# EAGLE design quadrotor (EAGLE 5.00)
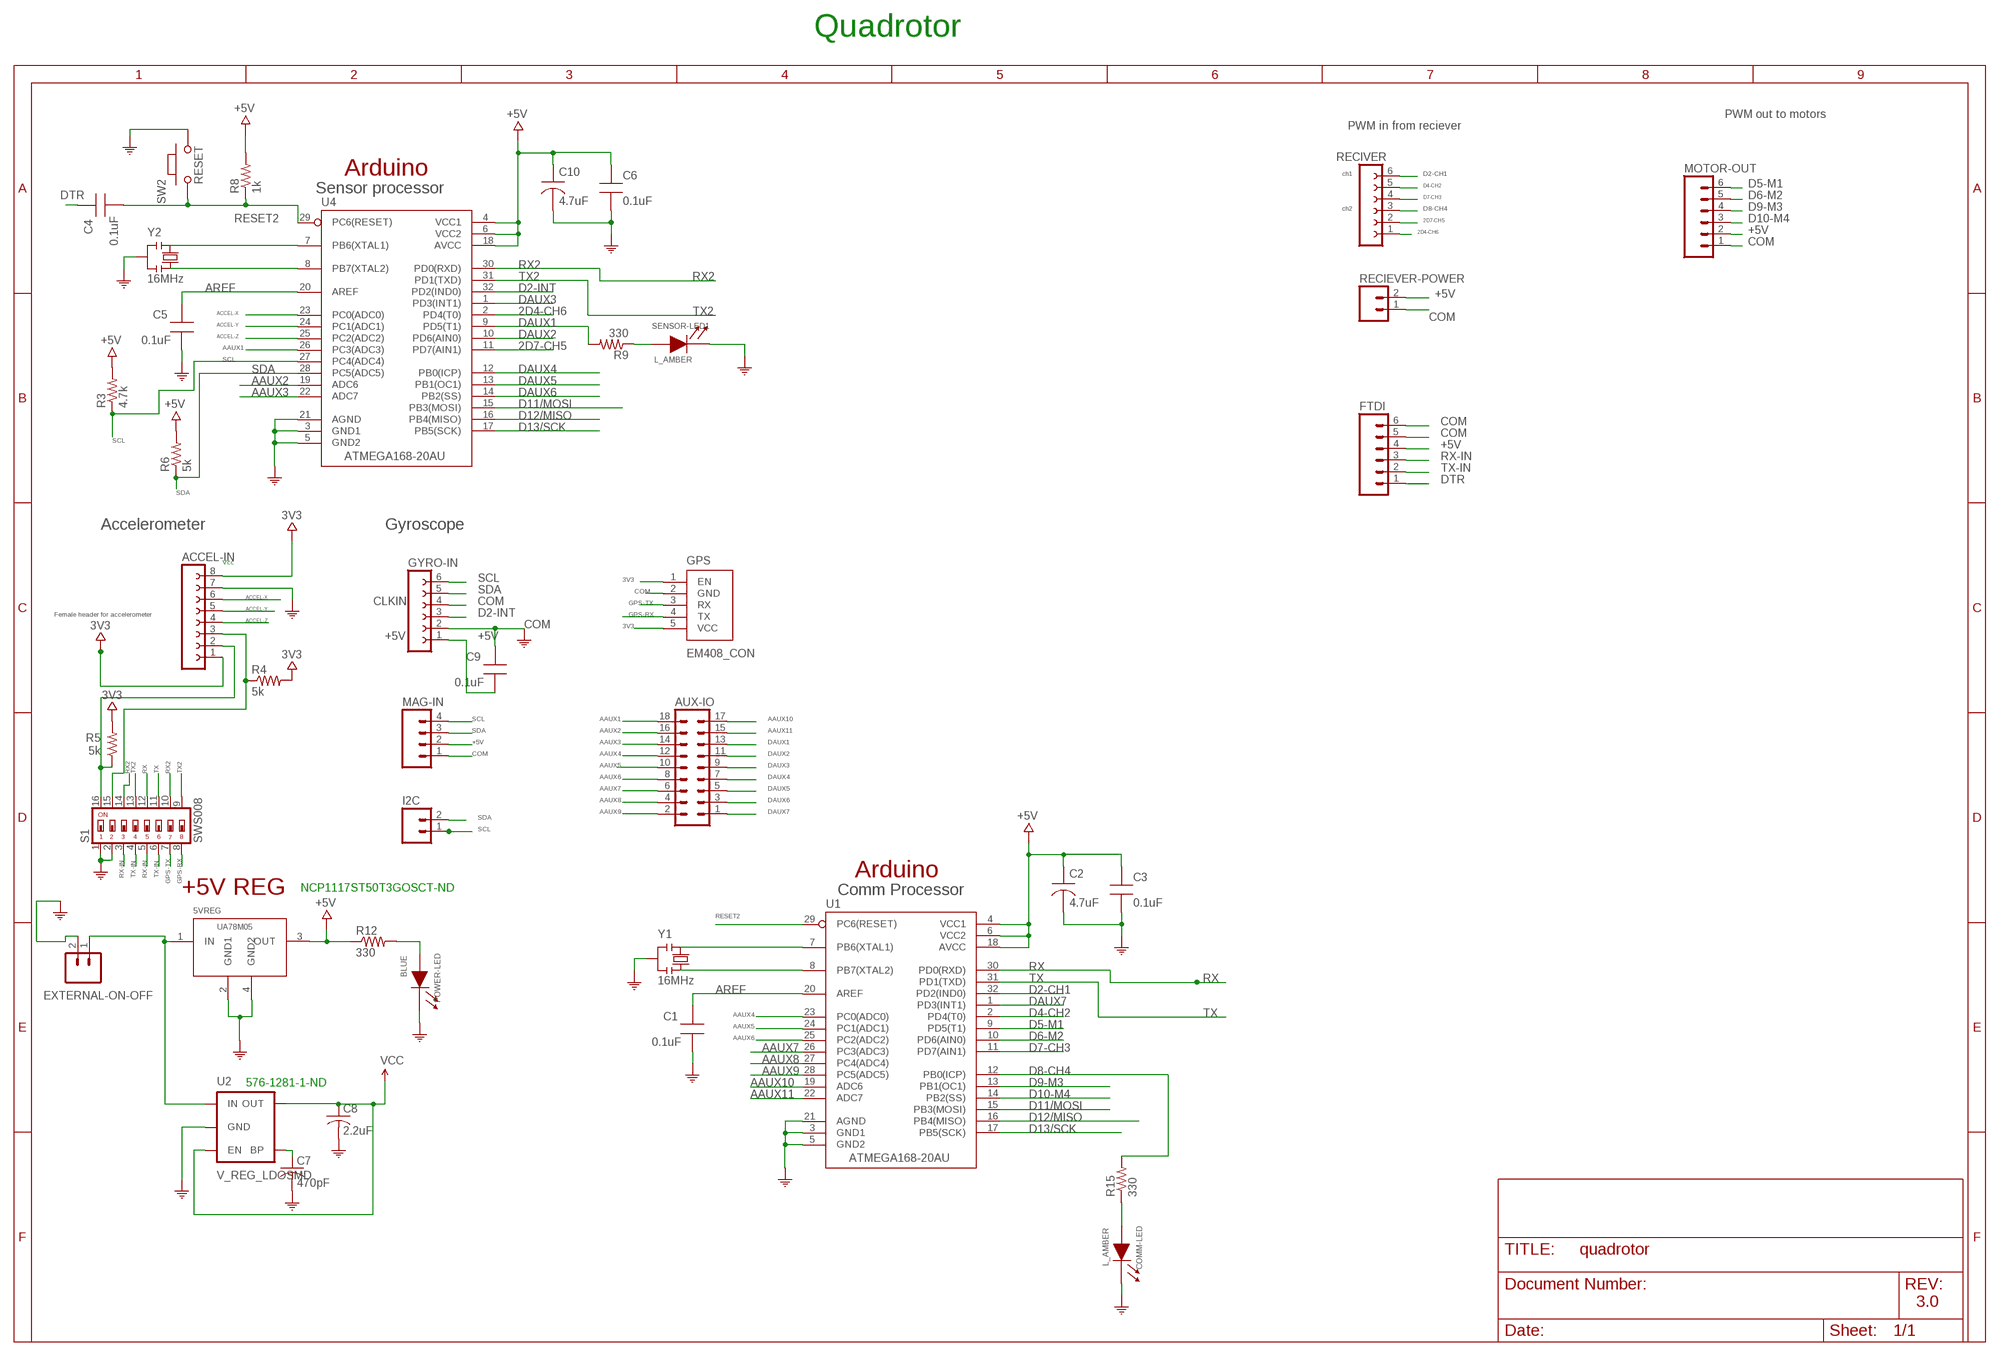
[diagram p0: schematic, sheet 1]

## Parts
5VREG  UA78M05  [SOT223]
ACCEL-IN  FE08-1  [FE08]
AUX-IO  MA09-2  [MA09-2]
C1  0.1uF  CAP0805-NP  [CAP0805-NP]
C2  4.7uF  CAP-TANA-P  [TAN-A]
C3  0.1uF  CAP0805-NP  [CAP0805-NP]
C4  0.1uF  CAP0805-NP  [CAP0805-NP]
C5  0.1uF  CAP0805-NP  [CAP0805-NP]
C6  0.1uF  CAP0805-NP  [CAP0805-NP]
C7  470pF  C-USC0805  [C0805]
C8  2.2uF  C-USC0805  [C0805]
C9  0.1uF  CAP0805-NP  [CAP0805-NP]
C10  4.7uF  CAP-TANA-P  [TAN-A]
COMM-LED  L_AMBER  LED0805  [LED0805]
EXTERNAL-ON-OFF  M02PTH3  [1X02_LONGPADS]
FTDI  M06SIP  [1X06]
GPS  EM408_CON  [EM408_CON]
GYRO-IN  FE06-1  [FE06]
I2C  M02PTH  [1X02]
MAG-IN  M04PTH  [1X04]
MOTOR-OUT  M06SIP  [1X06]
POWER-LED  BLUE  LED0805  [LED0805]
R3  4.7k  R-US_M0805  [M0805]
R4  5k  R-US_M0805  [M0805]
R5  5k  R-US_M0805  [M0805]
R6  5k  R-US_M0805  [M0805]
R8  1k  RESISTOR0603-RES  [0603-RES]
R9  330  RESISTOR0603-RES  [0603-RES]
R12  330  RESISTOR0603-RES  [0603-RES]
R15  330  RESISTOR0603-RES  [0603-RES]
RECIEVER-POWER  M02PTH  [1X02]
RECIVER  FE06-1  [FE06]
S1  SWS008  [SMS-008]
SENSOR-LED1  L_AMBER  LED0805  [LED0805]
SW2  RESET  PB157  [157SW]
U1  ATMEGA168-20AU  [QFP032]
U2  V_REG_LDOSMD  [SOT23-5]
U4  ATMEGA168-20AU  [QFP032]
Y1  16MHz  RESONATORMU  [RESONATOR]
Y2  16MHz  RESONATORMU  [RESONATOR]

## Nets
2D4-CH6: RECIVER.1 U4.2(PD4(T0))
2D7-CH5: RECIVER.2 U4.11(PD7(AIN1))
3V3: ACCEL-IN.1 ACCEL-IN.8 C8.1 GPS.1(EN) GPS.5(VCC) R4.2 R5.2 U2.3(EN) U2.5(OUT) ; supply symbol labelled VCC
+5V: 5VREG.3(OUT) C2.1 C3.1 C6.1 C9.2 C10.1 FTDI.4 GYRO-IN.1 MAG-IN.2 MOTOR-OUT.2 R3.2 R6.2 R8.2 R12.1 RECIEVER-POWER.2 U1.4(VCC1) U1.6(VCC2) U1.18(AVCC) U4.4(VCC1) U4.6(VCC2) U4.18(AVCC)
AAUX1: AUX-IO.18 U4.26(PC3(ADC3))
AAUX2: AUX-IO.16 U4.19(ADC6)
AAUX3: AUX-IO.14 U4.22(ADC7)
AAUX4: AUX-IO.12 U1.23(PC0(ADC0))
AAUX5: AUX-IO.10 U1.24(PC1(ADC1))
AAUX6: AUX-IO.8 U1.25(PC2(ADC2))
AAUX7: AUX-IO.6 U1.26(PC3(ADC3))
AAUX8: AUX-IO.4 U1.27(PC4(ADC4))
AAUX9: AUX-IO.2 U1.28(PC5(ADC5))
AAUX10: AUX-IO.17 U1.19(ADC6)
AAUX11: AUX-IO.15 U1.22(ADC7)
ACCEL-X: ACCEL-IN.6 U4.23(PC0(ADC0))
ACCEL-Y: ACCEL-IN.5 U4.24(PC1(ADC1))
ACCEL-Z: ACCEL-IN.4 U4.25(PC2(ADC2))
AREF: C1.1 C5.1 U1.20(AREF) U4.20(AREF)
COM: 5VREG.2(GND1) 5VREG.4(GND2) ACCEL-IN.7 C1.2 C2.2 C3.2 C5.2 C6.2 C7.2 C8.2 C9.1 C10.2 COMM-LED.1(CA) EXTERNAL-ON-OFF.2 FTDI.5 FTDI.6 GPS.2(GND) GYRO-IN.2 GYRO-IN.4 MAG-IN.1 MOTOR-OUT.1 POWER-LED.1(CA) RECIEVER-POWER.1 S1.1 S1.2 SENSOR-LED1.1(CA) SW2.2 U1.3(GND1) U1.5(GND2) U1.21(AGND) U2.2(GND) U4.3(GND1) U4.5(GND2) U4.21(AGND) Y1.2 Y2.2
D2-CH1: RECIVER.6 U1.32(PD2(IND0))
D2-INT: GYRO-IN.3 U4.32(PD2(IND0))
D4-CH2: RECIVER.5 U1.2(PD4(T0))
D5-M1: MOTOR-OUT.6 U1.9(PD5(T1))
D6-M2: MOTOR-OUT.5 U1.10(PD6(AIN0))
D7-CH3: RECIVER.4 U1.11(PD7(AIN1))
D8-CH4: R15.2 RECIVER.3 U1.12(PB0(ICP))
D9-M3: MOTOR-OUT.4 U1.13(PB1(OC1))
D10-M4: MOTOR-OUT.3 U1.14(PB2(SS))
D11/MOSI: U1.15(PB3(MOSI)) U4.15(PB3(MOSI))
D12/MISO: U1.16(PB4(MISO)) U4.16(PB4(MISO))
D13/SCK: U1.17(PB5(SCK)) U4.17(PB5(SCK))
DAUX1: AUX-IO.13 R9.2 U4.9(PD5(T1))
DAUX2: AUX-IO.11 U4.10(PD6(AIN0))
DAUX3: AUX-IO.9 U4.1(PD3(INT1))
DAUX4: AUX-IO.7 U4.12(PB0(ICP))
DAUX5: AUX-IO.5 U4.13(PB1(OC1))
DAUX6: AUX-IO.3 U4.14(PB2(SS))
DAUX7: AUX-IO.1 U1.1(PD3(INT1))
DTR: C4.1 FTDI.1
GPS-RX: GPS.4(TX) S1.8
GPS-TX: GPS.3(RX) S1.7
N$1: U1.8(PB7(XTAL2)) Y1.3
N$2: U1.7(PB6(XTAL1)) Y1.1
N$4: R9.1 SENSOR-LED1.2(AN)
N$5: 5VREG.1(IN) EXTERNAL-ON-OFF.1 U2.1(IN)
N$7: COMM-LED.2(AN) R15.1
N$28: POWER-LED.2(AN) R12.2
N$30: U4.7(PB6(XTAL1)) Y2.1
N$32: U4.8(PB7(XTAL2)) Y2.3
N$34: ACCEL-IN.3 R4.1 S1.15
N$36: ACCEL-IN.2 R5.1 S1.16
N$41: C7.1 U2.4(BP)
RESET2: C4.2 R8.1 SW2.1 U1.29(PC6(RESET)) U4.29(PC6(RESET))
RX: S1.12 U1.30(PD0(RXD))
RX2: S1.10 S1.14 U4.30(PD0(RXD))
RX-IN: FTDI.3 S1.3 S1.5
SCL: GYRO-IN.6 I2C.1 MAG-IN.4 R3.1 U4.27(PC4(ADC4))
SDA: GYRO-IN.5 I2C.2 MAG-IN.3 R6.1 U4.28(PC5(ADC5))
TX: S1.11 U1.31(PD1(TXD))
TX2: S1.9 S1.13 U4.31(PD1(TXD))
TX-IN: FTDI.2 S1.4 S1.6

## Notes on the sheet
- Quadrotor
- PWM out to motors
- PWM in from reciever
- Arduino | ch1
- Sensor processor
- ch2
- Accelerometer | Gyroscope
- Vcc
- CLKIN
- Female header for accelerometer
- Arduino
- NCP1117ST50T3GOSCT-ND
- +5V REG | Comm Processor
- 576-1281-1-ND
- 3.0

## Library data of the parts
5VREG = MySMD:UA78M05
ACCEL-IN = con-lsta:FE08-1: FEMALE HEADER; OC_FARNELL: unknown; OC_NEWARK: unknown
AUX-IO = con-lstb:MA09-2: PIN HEADER; OC_FARNELL: unknown; OC_NEWARK: unknown
C1 C3-C6 C9 = MySMD:CAP0805-NP
C2 C10 = MySMD:CAP-TANA-P
C7 C8 = rcl:C-US: CAPACITOR, American symbol
COMM-LED POWER-LED SENSOR-LED1 = MySMD:LED0805
EXTERNAL-ON-OFF I2C RECIEVER-POWER = SparkFun:M02: Header 2 Standard 2-pin 0.1" header. Use with straight break away headers (SKU : PRT-00116), right angle break away headers (PRT-00553), swiss pins (PRT-00743), machine pins (PRT-00117), and female headers (PRT-00115). Molex polarized connector foot print use with SKU : PRT-08233 with associated crimp pins and housings.
FTDI MOTOR-OUT = SparkFun:M06: Header 6 Standard 6-pin 0.1" header. Use with straight break away headers (SKU : PRT-00116), right angle break away headers (PRT-00553), swiss pins (PRT-00743), machine pins (PRT-00117), and female headers (PRT-00115). Molex polarized connector foot print use with SKU : PRT-08094 with associated crimp pins and housings. NOTES ON THE VARIANTS LOCK and LOCK_LONGPADS... This footprint was designed to help hold the alignment of a through-hole component (i.e. 6-pin header) while soldering it into place. You may notice that each hole has been shifted either up or down by 0.005 of an inch from it's more standard position (which is a perfectly straight line). This slight alteration caused the pins (the squares in the middle) to touch the edges of the holes. Because they are alternating, it causes a "brace" to hold the component in place. 0.005 has proven to be the perfect amount of "off-center" position when using our standard breakaway headers. Although looks a little odd when you look at the bare footprint, once you have a header in there, the alteration is very hard to notice. Also, if you push a header all the way into place, it is covered up entirely on the bottom side. This idea of altering the position of holes to aid alignment will be further integrated into the Sparkfun Library for other footprints. It can help hold any component with 3 or more connection pins.
GPS = SparkFun:EM408_CON: This is the mating connector for the EM408 GPS receiver. The EM408 connects to the board via a cable, this connector footprint does not include the outline of the receiver. You should include the "EM408_Outline" device in your schematic if you are to use the EM408 in your design.
GYRO-IN RECIVER = con-lsta:FE06-1: FEMALE HEADER; OC_FARNELL: unknown; OC_NEWARK: unknown
MAG-IN = SparkFun:M04: Header 4 Standard 4-pin 0.1" header. Use with straight break away headers (SKU : PRT-00116), right angle break away headers (PRT-00553), swiss pins (PRT-00743), machine pins (PRT-00117), and female headers (PRT-00115). Molex polarized connector foot print use with SKU : PRT-08231 with associated crimp pins and housings. 1MM SMD Version SKU: PRT-10208
R3-R6 = resistor:R-US_: RESISTOR, American symbol
R8 R9 R12 R15 = SparkFun:RESISTOR: Resistor Basic schematic elements and footprints for 0603, 1206, and PTH resistors.
S1 = smd-special:SWS008: SMD Dip Switch 8 pol.
SW2 = MySMD:PB157
U1 U4 = MySMD:ATMEGA168-20AU
U2 = SparkFun:V_REG_LDO: Voltage Regulator LDO Standard 150mA LDO voltage regulator in SOT-23 layout. Micrel part MIC5205. BP (by-pass) pin is used to lower output noise with 470pF cap.
Y1 Y2 = MySMD2:RESONATOR

## Board
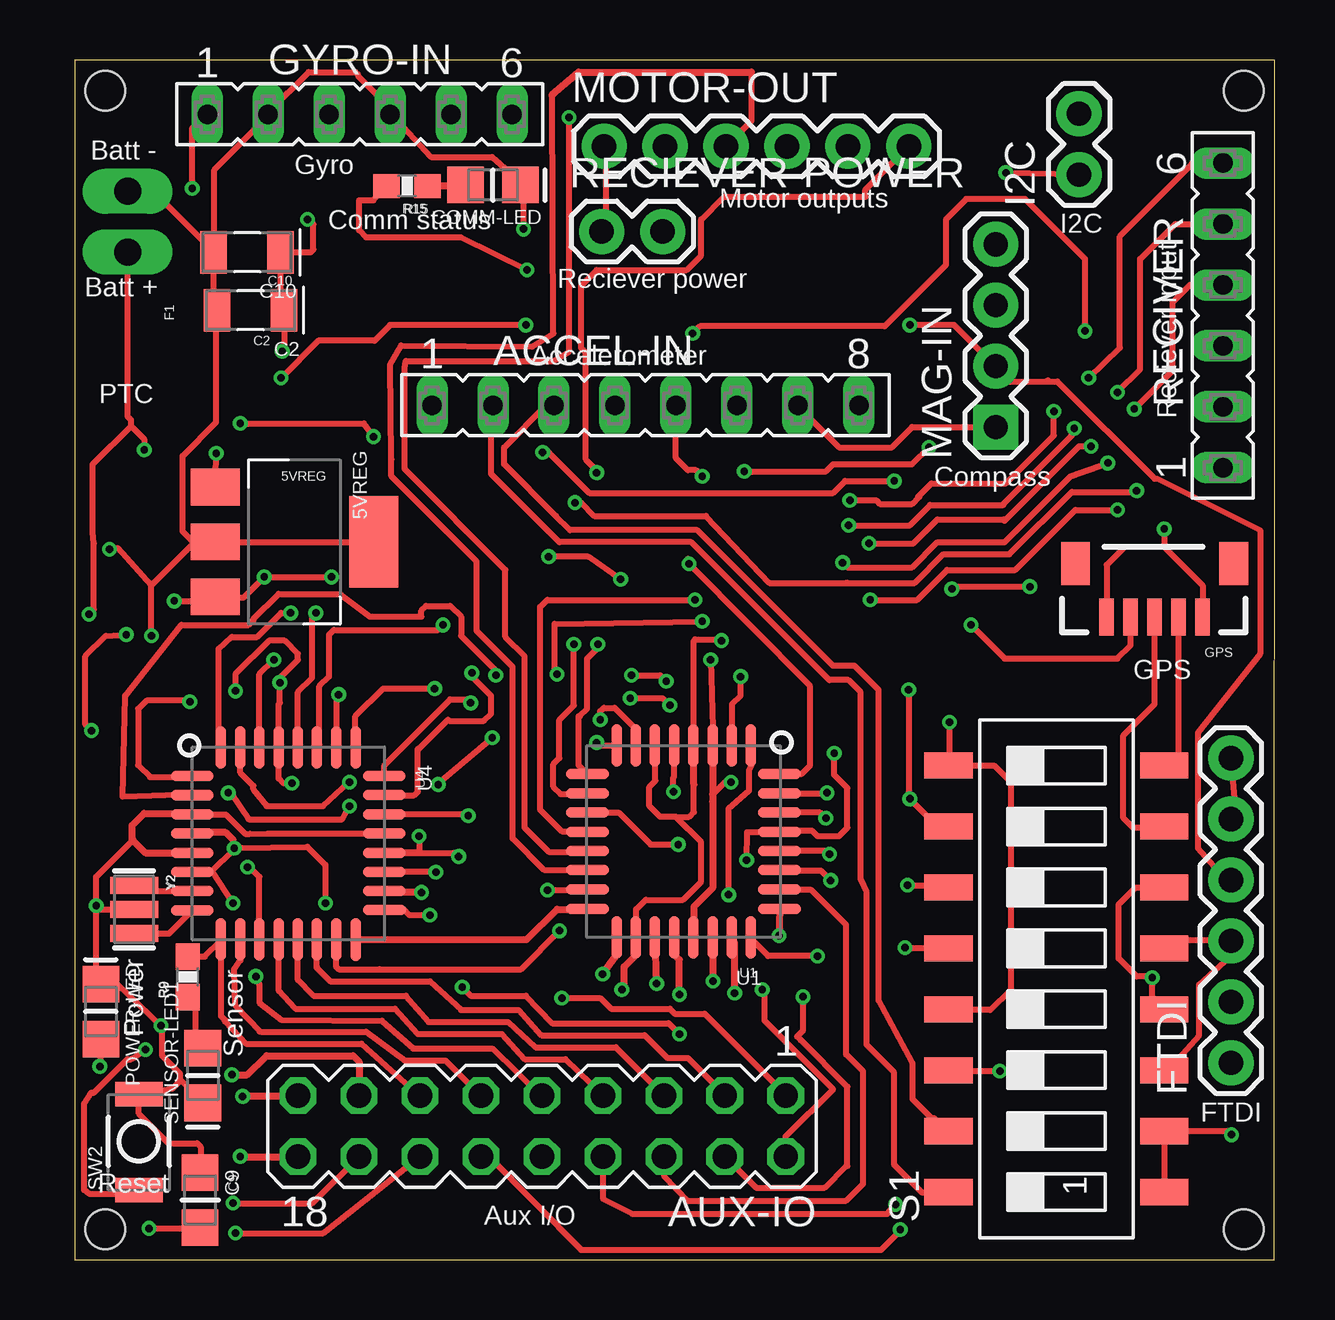
[diagram p1: board, top side]
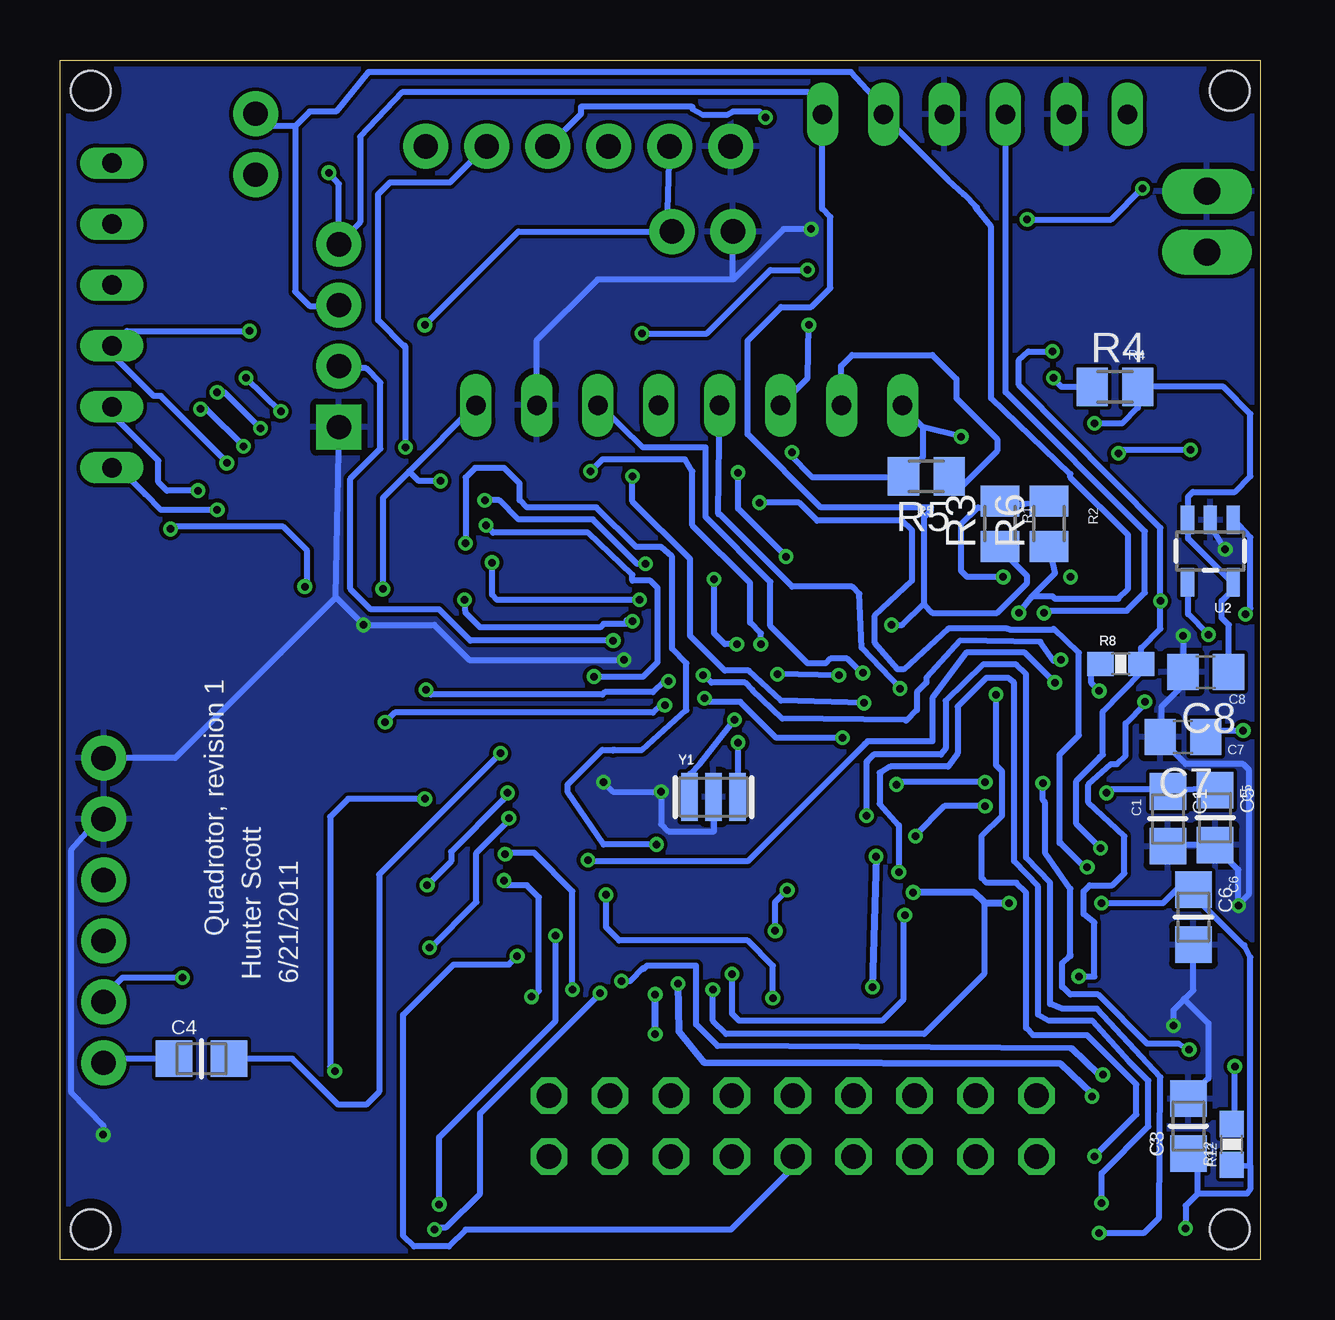
[diagram p2: board, bottom side, seen from below]

Size 50 x 50 mm. Coordinates in mm from the lower left corner, seen from the top.
Outline: 0,0 49.98,0 50,50 0,50 0,0
Copper layers (1*16): Top 0.035mm / dielectric 1.5mm / Bottom 0.035mm
Design rules "ITead_rule": minimum track width 6mil, minimum drill 12mil, track to track 6mil, track to pad 6mil, pad to pad 6mil, via to via 6mil, smd to smd 0mil, copper to edge 10mil, drill to drill 10mil, minimum pad ring 10mil, minimum via ring 6mil, stop-mask expansion 2mil, vias tented up to drill 100mil, thermal gap 10mil
Holes 1.65 mm at 1.27,1.27 48.71,1.27 48.71,48.71 1.27,48.71
tRestrict: area 0.1,0.1 to 2.4,2.4; area 47.6,47.6 to 49.9,49.9; area 47.6,0.1 to 49.9,2.4; area 0.1,47.6 to 2.4,49.9
bRestrict: area 47.6,0.1 to 49.9,2.4; area 0.1,47.6 to 2.4,49.9; area 47.6,47.6 to 49.9,49.9; area 0.1,0.1 to 2.4,2.4

### Footprints (pad centres in the part's own frame; a part is rotated, then mirrored left to right if it is on the bottom)
SOT223 = smd 1.524 x 2.032: 1 0,0; 2 2.286,0; 3 4.572,0 | smd 3.81 x 2.032: 4 2.286,6.604
FE08 = drill 0.813 long: 1 -8.89,0; 2 -6.35,0; 3 -3.81,0; 4 -1.27,0; 5 1.27,0; 6 3.81,0; 7 6.35,0; 8 8.89,0
MA09-2 = drill 1.016 octagon: 1 -10.16,-1.27; 2 -10.16,1.27; 3 -7.62,-1.27; 4 -7.62,1.27; 5 -5.08,-1.27; 6 -5.08,1.27; 7 -2.54,-1.27; 8 -2.54,1.27; 9 0,-1.27; 10 0,1.27; 11 2.54,-1.27; 12 2.54,1.27; 13 5.08,-1.27; 14 5.08,1.27; 15 7.62,-1.27; 16 7.62,1.27; 17 10.16,-1.27; 18 10.16,1.27
CAP0805-NP = smd 1.524 x 1.524: 1 0,0; 2 2.286,0
TAN-A = smd 1.118 x 1.778: 1 0,0; 2 2.794,0
C0805 = smd 1.3 x 1.5: 1 -0.95,0; 2 0.95,0
LED0805 = smd 1.524 x 1.524: 1 0,0; 2 2.286,0
1X02_LONGPADS = drill 1.118 pad 1.88 long: 1 0,0; 2 2.54,0
1X06 = drill 1.016 pad 1.88 round: 1 0,0; 2 2.54,0; 3 5.08,0; 4 7.62,0; 5 10.16,0; 6 12.7,0
EM408_CON = smd 0.6 x 1.55: 1 4,0; 2 3,0; 3 2,0; 4 1,0; 5 0,0 | smd 1.2 x 1.8: P$1 -1.3,-2.225; P$2 5.3,-2.225
FE06 = drill 0.813 long: 1 -6.35,0; 2 -3.81,0; 3 -1.27,0; 4 1.27,0; 5 3.81,0; 6 6.35,0
1X02 = drill 1.016 pad 1.88 round: 1 0,0; 2 2.54,0
1X04 = drill 1.016 pad 1.88 square: 1 0,0 | drill 1.016 pad 1.88 round: 2 2.54,0; 3 5.08,0; 4 7.62,0
M0805 = smd 1.3 x 1.6: 1 -0.95,0; 2 0.95,0
0603-RES = smd 1.1 x 1: 1 -0.85,0; 2 0.85,0
SMS-008 = smd 1.092 x 2.007: 1 -8.89,-4.496; 2 -6.35,-4.496; 3 -3.81,-4.496; 4 -1.27,-4.496; 5 1.27,-4.496; 6 3.81,-4.496; 7 6.35,-4.496; 8 8.89,-4.496; 9 8.89,4.496; 10 6.35,4.496; 11 3.81,4.496; 12 1.27,4.496; 13 -1.27,4.496; 14 -3.81,4.496; 15 -6.35,4.496; 16 -8.89,4.496
157SW = smd 1.016 x 1.981: 1 0,0; 2 4,0
QFP032 = smd 0.432 x 1.778: 1 0,0; 2 0.8,0; 3 1.599,0; 4 2.399,0; 5 3.199,0; 6 3.998,0; 7 4.798,0; 8 5.598,0; 17 5.588,8.001; 18 4.798,7.997; 19 3.998,7.997; 20 3.199,7.997; 21 2.399,7.997; 22 1.599,7.997; 23 0.799,7.997; 24 0,7.997 | smd 1.778 x 0.432: 9 6.807,1.194; 10 6.807,2.007; 11 6.807,2.794; 12 6.807,3.607; 13 6.807,4.394; 14 6.807,5.182; 15 6.807,5.994; 16 6.816,6.803; 25 -1.194,6.807; 26 -1.194,5.994; 27 -1.194,5.182; 28 -1.194,4.394; 29 -1.194,3.607; 30 -1.194,2.794; 31 -1.194,2.007; 32 -1.194,1.194
SOT23-5 = smd 0.55 x 1.2: 1 -0.95,-1.3; 2 0,-1.3; 3 0.95,-1.3; 4 0.95,1.3; 5 -0.95,1.3
RESONATOR = smd 0.7 x 2: 1 -1,0; 2 0,0; 3 1,0

### Placement (x,y rotation side)
5VREG  5.86,32.2 270 top
ACCEL-IN  23.78,35.61 0 top
AUX-IO  19.47,5.56 180 top
C1  3.84,19.51 270 bottom
C2  8.72,39.57 180 top
C3  2.99,4.42 90 bottom
C4  45.25,8.37 0 bottom
C5  1.87,19.56 270 bottom
C6  2.77,15.41 270 bottom
C7  3.21,21.78 180 bottom
C8  2.26,24.48 180 bottom
C9  5.23,3.62 270 top
C10  8.58,41.98 180 top
COMM-LED  18.57,44.78 180 top
EXTERNAL-ON-OFF  2.21,41.99 90 top
FTDI  48.18,8.2 90 top
GPS  47,26.78 180 top
GYRO-IN  11.88,47.74 0 top
I2C  41.85,45.22 90 top
MAG-IN  38.38,34.7 90 top
MOTOR-OUT  22.06,46.4 0 top
POWER-LED  1.09,11.48 270 top
R3  10.84,30.67 90 bottom
R4  6.04,36.38 0 bottom
R5  13.9,32.64 180 bottom
R6  8.79,30.67 90 bottom
R8  5.8,24.82 0 bottom
R9  4.71,11.78 90 top
R12  1.18,4.8 90 bottom
R15  13.85,44.75 180 top
RECIEVER-POWER  21.96,42.85 0 top
RECIVER  47.84,39.35 90 top
S1  40.91,11.7 90 top
SENSOR-LED1  5.34,6.53 90 top
SW2  2.68,2.89 90 top
U1  28.18,21.43 180 top
U2  2.07,29.53 180 bottom
U4  4.9,20.15 270 top
Y1  22.77,19.27 0 bottom
Y2  2.48,14.59 270 top

### Tracks (layer width: path | path; a pad name or v marks a point on that pad's centre or on a via)
2D4-CH6  (via drill 0.31)
  Top 0.25: U4.2 5,19.4 2,19.3 2.1,23.5 4.45,26.45 7.25,26.45 7.45,26.65 7.45,26.7 8.5,27.75 11.05,27.75 12.3,26.8 14.45,26.8 14.45,27.05 14.65,27.25 15.65,27.25 16.1,26.8 16.1,26 17.55,24.55 v17.55,24.35 17.55,24.3 | v43.45,31.25 41.7,31.25 39.2,28.75 36.35,28.75 35.1,27.5 v33.15,27.5 | v26.15,26.6 20,26.5 20,24.45 v20.1,24.4
  Bottom 0.25: v17.55,24.35 v20.1,24.4 | 46.45,31.9 45.8,31.25 v43.45,31.25 | 26.4,26.65 v26.15,26.6 26.2,26.45 26.25,26.5 27.35,26.5 27.5,26.35 32.5,26.35 33.1,26.95 v33.15,27.5 | 46.45,31.9 | RECIVER.1 47.55,33 46.45,31.9
2D7-CH5  (via drill 0.31)
  Top 0.25: v44.25,32.05 44.2,32 41.55,32 38.95,29.4 36.2,29.4 35,28.2 32.2,28.2 | 7.75,13.25 7.7,13.3 U4.11 7.7,13.25 | 32.2,28.2 32.15,28.2 | 32.2,28.2 28.95,28.2 26.3,31 21.65,31 21.1,31.55 v20.85,31.55 | v7.2,16.35 7.3,16.35 7.7,15.95 7.7,13.25 | 7.7,13.25 7.75,13.2
  Bottom 0.25: RECIVER.2 47.84,35.24 45.9,33.3 45.9,32.4 45.55,32.05 v44.25,32.05 44.2,32.05 | 15.1,24.6 15.15,24.65 | v20.85,31.55 19.2,31.55 18.45,30.8 14.9,30.8 14.5,30.4 14.5,28.3 16.05,26.85 16.05,25.7 15.1,24.6 | 15.1,24.6 14.85,24.6 13,26.3 10.55,26.3 10.4,26.25 8.6,26.25 8.6,26.3 7.55,25.3 7.55,21.85 8.35,21.05 8.35,17.35 8.3,17.35 7.3,16.35 v7.2,16.35
3V3  (via drill 0.31)
  Top 0.25: v45.4,30.45 45.4,29.7 | 45.4,29.7 47,28.1 GPS.5 | 45.4,29.7 43.75,29.7 43,28.95 GPS.1 43,26.7 | v39.8,28.05 36.65,28.05 v36.55,27.95 | v19.5,33.65 19.7,33.7 21.45,31.95 31.6,31.95 32.1,32.45 v34.15,32.45 | v6.9,34.85 12.05,34.85 v12.45,34.3
  Bottom 0.25: 3.02,30.73 3.05,30.7 | 3.02,30.73 U2.3 | 3,30.75 3,31.8 2.8,32 1.05,32 0.4,32.65 0.4,35.25 1.53,36.38 R4.2 5.09,35.51 5.75,34.85 v6.9,34.85 | 3,30.75 3.02,30.73 | U2.5 1.18,28.23 3,30.05 3,30.75 | U2.3 3.05,30.8 3,30.75 | U2.3 | v45.4,30.45 45.3,30.55 40.7,30.55 39.7,29.55 39.7,28.15 v39.8,28.05 | U2.5 | U2.5 1.26,28.09 1.26,27.79 1.6,27.45 1.6,26.75 1.3,26.45 1.3,24.5 C8.1 | ACCEL-IN.8 32.69,35.61 35.45,32.85 | v36.55,27.95 36.55,31.75 35.45,32.85 | v34.15,32.45 35.05,32.45 35.45,32.85 | ACCEL-IN.1 14.89,35.56 14.9,35.55 14.05,34.7 | v12.45,34.3 14.05,34.7 | 14.86,32.64 14.9,32.6 18.65,32.6 19.6,33.55 v19.5,33.65 | 14.86,32.64 R5.2 | 14.05,34.7 14.05,33.45 14.86,32.64 | 1.65,24.8 1.33,24.48 C8.1 | C8.1 1.26,24.54 | C8.1 1.35,24.45
+5V  (via drill 0.31)
  Top 0.25: FTDI.4 47.98,15.82 46.8,17.15 46.8,21.95 49.4,25.25 49.4,30.4 45.1,32.55 45,32.55 40.95,36.6 40.5,36.6 | 40.5,36.6 38.65,36.6 38.53,36.72 MAG-IN.2 38.38,37.22 | 40.5,36.6 40.55,36.65 | 25.8,21.5 25.8,25.8 25.85,25.85 26.9,25.85 v26.95,25.8 | 8.72,39.53 8.75,39.5 8.75,37.95 v8.65,37.85 | 8.72,39.53 C2.1 | 8.72,39.53 8.58,39.67 C10.1 9.83,41.98 9.95,42.1 9.95,43.15 9.75,43.35 v9.7,43.35 | 6.3,17.8 6.35,17.8 | 5.9,27.6 5.88,27.62 5VREG.3 | v4.15,27.45 5.75,27.45 5.9,27.6 | 38.38,37.22 38.4,37.2 | v34.8,38.95 36.65,38.95 38.38,37.22 | GYRO-IN.1 5.51,47.74 5.5,47.75 4.9,47.15 v4.9,44.65 | U1.18 23.38,13.37 23.4,13.35 23.4,14.6 23.8,15 25.35,15 26.1,15.75 26.1,17.4 25.05,18.45 | 5.03,1.33 5.05,1.35 | 5.03,1.33 C9.2 | v3.1,1.3 5,1.3 5.03,1.33 | 5.5,16.11 U4.6 5.7,16.16 | 5.75,16.16 5.7,16.16 | v6.6,14.85 5.75,16.16 | 5.75,16.16 5.75,16.2 | 24.2,21.5 24.2,19.95 23.95,19.7 23.95,18.9 24.4,18.45 25.05,18.45 | 25.8,19.8 25.8,18.65 25.6,18.45 25.05,18.45 | v10.7,28.45 v7.9,28.45 7.05,27.6 5.9,27.6 | v6.65,17.15 9.7,17.2 10.45,16.45 v10.45,14.85 | 6.85,17.2 6.75,17.2 6.7,17.15 | v6.65,17.15 6.7,17.15 | 6.6,17.5 6.6,17.25 6.7,17.15 | 5.7,16.16 5.7,16.15 6.65,17.1 v6.65,17.15
  Top 0.3: U1.18 23.38,12.68 22.9,12.2 22.9,11.3 v22.8,11.25 | 12.9,15.4 | 12.9,15.4 U4.18 | v14.45,15.3 13,15.3 12.9,15.4 | 6.6,17.5 6.3,17.8 5.1,17.8 5,17.7 4.95,17.75 U4.4 | 24.2,21.5 24.18,21.48 U1.6 | U1.4 25.78,21.48 25.8,21.5 25.8,19.8
  Bottom 0.25: v22.8,11.25 22.8,9.95 22.25,9.4 14,9.4 11.5,11.9 11.5,14.9 | MAG-IN.2 38.38,37.22 38.4,37.2 38.35,37.15 37.25,37.15 36.65,36.55 36.65,33.8 37.9,32.55 37.9,27.95 37.05,27.1 34.2,27.1 33.85,26.75 | 0.4,3.9 0.4,2.95 0.55,2.75 2.6,2.75 | 0.4,3.9 0.4,12.6 0.65,13.1 0.65,13.05 2.77,15.17 C6.1 2.77,15.38 2.8,15.35 3.1,15.65 3.25,15.65 4.05,14.85 v6.6,14.85 6.65,14.8 | v4.15,27.45 4.2,27.45 4.15,27.4 v4.15,27.45 | v34.8,38.95 30.9,42.85 RECIEVER-POWER.2 24.7,43.05 MOTOR-OUT.2 | v9.7,43.35 6.2,43.35 v4.9,44.65 | v8.65,37.85 9.65,37.85 10.05,37.5 10.05,36.45 4.15,30.5 v4.15,27.45 | 2.6,2.75 3.1,2.25 v3.1,1.3 | R12.1 0.4,3.9 | 6.71,20.91 6.55,21.05 | C3.1 3.05,4.35 2.6,3.9 2.6,2.75 | 4.95,24.8 5,24.75 | R8.2 4.95,24.8 | 4.95,24.8 4.7,25.05 | R8.2 4.95,24.5 6.55,22.85 6.55,21.05 | 6.71,20.91 6.7,20.9 6.55,21.05 | 6.71,20.91 6.71,20.89 7.65,19.95 7.65,18.15 v6.65,17.15 | v26.95,25.8 32.9,25.8 33.85,26.75 | 33.85,26.75 33.95,26.85 | v4.15,27.45 4.15,26.3 4.95,25.5 4.95,24.9 5,24.85 4.97,24.82 R8.2 | 10.53,31.42 R3.2 | 10.53,31.42 R6.2 | 10.53,31.42 10.6,31.35 11.75,31.35 12.45,30.65 12.45,28.7 12.2,28.45 v10.7,28.45
  Bottom 0.3: v14.45,15.3 11.9,15.3 11.5,14.9 11.45,14.85 v10.45,14.85
AAUX1  (via drill 0.31)
  Top 0.25: 10.9,21.3 10.9,23.45 v11,23.55
  Top 0.3: AUX-IO.18 v6.91,4.29 v6.9,4.3 | 10.9,21.3 U4.26
  Bottom 0.25: v6.9,4.3 5.15,6.05 5.15,7.3 7.2,9.35 9.45,9.35 9.75,9.65 9.75,15.3 10.15,15.7 11.4,15.7 11.6,15.9 11.6,17.65 10.75,18.5 10.75,20.35 11,20.6 v11,23.55
AAUX2  (via drill 0.31)
  Top 0.25: AUX-IO.16 9.91,2.35 v6.6,2.35 | U4.19 v15.05,16.15
  Bottom 0.25: 15,16.15 v15.05,16.15 15.05,18.1 15.85,19 15.85,20.3 15.8,20.3 15.4,20.55 13,20.55 12.6,21.1 12.6,23.05 11.4,24.25 10.5,24.25 10.25,24.05 10.25,16.6 9.25,15.55 9.25,10.2 8.8,9.95 7,9.95 5.45,8.25 4.65,7.45 4.65,5.55 6.6,3.6 v6.6,2.35
AAUX3  (via drill 0.31)
  Top 0.25: AUX-IO.14 10.35,1.1 v6.7,1.1 | U4.22 16.35,18.55 v16.4,18.5
  Bottom 0.25: 16.35,20.75 16.35,20.8 | 16.35,20.75 16.4,20.75 16.1,21.05 13.3,21.05 13.1,21.3 13.1,23.3 11.55,24.8 10.15,24.8 9.75,24.4 9.75,16.75 8.75,15.7 8.75,14.6 | v16.4,18.5 16.4,20.7 16.35,20.75 | 8.75,14.6 8.75,10.65 8.25,10.45 6.8,10.45 4.15,7.6 4.2,1.75 4.85,1.1 v6.7,1.1 | 8.75,14.6 8.75,14.8
AAUX4  (via drill 0.31)
  Top 0.25: AUX-IO.12 17.25,4.3 21.1,0.4 33.6,0.4 34.4,1.2 v34.4,1.25
  Top 0.3: U1.23 27.33,13.43 27.3,13.4 27.5,13.2 v27.5,11.1
  Bottom 0.25: v27.5,11.1 32.5,6.1 32.5,2.75 33.9,1.35 34.3,1.35 v34.4,1.25 34.45,1.2
AAUX5  (via drill 0.31)
  Top 0.25: U1.24 28.15,13.4 28.9,12.65 v30.95,12.65 | U1.24
  Bottom 0.25: v30.95,12.65 31.3,12.3 33.6,12.3 35.7,10.2 35.7,1 35.25,0.55 33.8,0.55 33.1,1.25 22.05,1.25 19.47,3.83 AUX-IO.10
AAUX6  (via drill 0.31)
  Top 0.25: AUX-IO.8 22.01,2.54 23.25,1.9 33.85,1.9 v34.2,2.3
  Top 0.3: U1.25 29.38,14.62 29.4,14.6 v29.35,13.5
  Bottom 0.25: v34.2,2.3 34.25,2.3 34.2,2.35 34.2,5.1 29.35,9.95 v29.35,13.5
AAUX7
  Top 0.25: 32.85,7.8 32.83,7.84 32.84,7.84 32.85,7.85 | AUX-IO.6 24.55,3.5 25.55,2.45 32.15,2.45 32.85,3.15 32.85,7.85 | 30.1,15.4 30.7,15.4 32.15,13.95 32.15,8.55 32.85,7.85
  Top 0.3: U1.26 29.33,15.43 29.3,15.4 30.1,15.4
AAUX8  (via drill 0.31)
  Top 0.25: 30.25,9.15 32.2,7.2 32.2,3.9 32.15,3.9 31.25,3 28.4,3 27.11,4.29 AUX-IO.4 | 30.25,9.15 30.2,9.2 | 30.25,9.15 30.1,9.3 30.35,9.55 v30.35,10.95 | 29.3,16.2 31.1,16.2 v31.5,15.8
  Top 0.3: 29.3,16.2 29.34,16.25 U1.27
  Bottom 0.25: v31.5,15.8 31.5,15.6 30.55,15.6 30.05,15.1 30.05,11.2 30.35,10.9 v30.35,10.95
AAUX9  (via drill 0.31)
  Top 0.25: 28.75,11.15 28.75,9.95 31.6,7.1 29.63,5.13 AUX-IO.2 | U1.28 31.32,17.03 v31.45,16.9
  Top 0.3: 28.75,11.15 v28.65,11.25
  Bottom 0.25: v28.65,11.25 28.65,15.35 30.25,16.95 31.4,16.95 v31.45,16.9
AAUX10  (via drill 0.31)
  Top 0.3: AUX-IO.17 7.03,6.83 v7,6.8 | U1.19 24.18,13.42 24.2,13.4 v24.25,11.5
  Bottom 0.3: v7,6.8 7,6.9 8.3,8.15 23.15,8.2 24.2,9.5 v24.25,11.5
AAUX11  (via drill 0.31)
  Top 0.3: AUX-IO.15 11.85,8.25 11.6,8.5 8,8.5 7.2,7.7 v6.55,7.7 | U1.22 26.6,13.4 v26.6,11.6
  Bottom 0.25: v26.6,11.6 26.25,11.6 25.7,12.15 25.7,12.1 25.55,12.25 23.5,12.25 23.5,9.8 22.6,8.9 7.85,8.8
  Bottom 0.3: v6.55,7.7 6.7,7.7 7.85,8.8
ACCEL-X  (via drill 0.31)
  Top 0.25: U4.23 12.99,19.36 13.05,19.3 13.1,19.35 14.15,19.35 14.3,19.5 14.3,21.25 | 14.3,21.25 14.3,21.3 | v16.55,24.45 16.55,24.3 17.35,23.5 17.35,22.75 17.05,22.45 15.6,22.45 15.55,22.5 14.3,21.25
  Bottom 0.25: ACCEL-IN.6 27.51,35.61 25.7,33.85 23.1,33.85 23.1,30.95 20.4,28.25 20.4,26.4 18.85,24.85 18.1,24.85 17.9,25.05 17.2,25.05 16.6,24.45 v16.55,24.45
ACCEL-Y  (via drill 0.31)
  Top 0.25: U4.24 12.9,20.6 15.65,23.35 16.35,23.35 v16.5,23.2 | ACCEL-IN.5 25.05,33.4 25.55,32.9 25.9,32.9 v26.15,32.65
  Bottom 0.25: v26.15,32.65 26.15,31.6 23.75,29.2 23.75,26 22.3,24.55 21.3,24.55 19.95,23.3 v16.5,23.2
ACCEL-Z  (via drill 0.31)
  Top 0.25: U4.25 | U4.25 11.71,21.34 11.75,21.3 11.8,21.35 | 11.7,21.5 11.71,21.49 U4.25 | v15,23.8 12.85,23.8 11.7,22.65 11.7,21.3 11.71,21.29 | 11.71,21.29 11.75,21.25 | U4.25 11.71,21.29
  Bottom 0.25: ACCEL-IN.4 22.56,31.06 22.51,31.06 19.5,28.05 17,28.05 16.7,27.75 | v15,23.8 16.6,25.5 16.69,27.75 16.7,27.75 | 16.7,27.75
AREF  (via drill 0.31)
  Top 0.25: v25.2,9.4 24.75,9.85 19.9,9.85 18.8,11 16.5,11 v16.15,11.35 | U4.20 12.95,16.9 | U4.20 | U4.20 | U4.20 12.95,16.95 13,16.9 | v14.35,17.65 14.35,16.95 15.85,16.95 v16,16.8 | v6.4,19.45 6.5,19.45 7.25,18.35 11.15,18.35 v11.45,18.9
  Top 0.3: 14.35,16.95 U4.20 | v25.2,11.05 25.2,12.5 25,12.7 25,13.4 U1.20
  Bottom 0.25: 1.86,19.56 1.85,19.55 | C5.1 1.86,19.56 | 1.86,19.56 1.96,19.66 C1.1 4.04,19.66 4.1,19.6 6.3,19.6 6.45,19.45 v6.4,19.45 | v14.35,17.65 14.35,17.7 13.15,18.9 v11.45,18.9
  Bottom 0.3: v16,16.8 v16.15,11.35 | v25.2,9.4 v25.2,11.05
COM  (via drill 0.31)
  Top 0.25: FTDI.5 48.38,18.48 48.4,18.5 48.38,18.52 FTDI.6 | U1.3 26.6,21.45 v26.5,25 | U1.5 24.98,20.13 24.95,20.1 v24.95,19.5 | 26.58,19.4 26.6,19.4 27.1,19.9 v27.35,19.9 | C10.2 5.79,41.91 5.85,41.85 | 5.9,39.45 5.93,39.48 C2.2 | C10.2 5.79,39.56 5.9,39.45 | 8.14,47.74 8.15,47.75 | 8.14,47.74 GYRO-IN.2 8.07,47.82 9.75,49.5 11.7,49.5 11.8,49.4 11.8,49.35 13.2,47.95 13.15,47.9 GYRO-IN.4 13.21,47.74 14.85,45.95 17.4,45.95 18.62,44.88 | 8.14,47.74 5.82,45.42 5.82,41.93 | 18.62,44.88 18.7,44.8 v18.7,42.95 | 18.62,44.88 COMM-LED.1 | 5.9,39.45 5.9,34.9 4.5,33.5 4.5,30.35 4.95,29.9 5,29.9 | 5.86,29.89 5.9,29.85 | 5.86,29.89 5VREG.2 12.44,29.91 12.46,29.89 | 5,29.9 5VREG.2 5.86,29.89 | 12.46,29.89 12.5,29.85 | 12.46,29.89 5VREG.4 | 2.4,17.5 2.45,17.5 0.9,15.95 v0.9,14.75 | MAG-IN.1 34.9,34.7 34.05,33.85 31.85,33.85 30.13,35.57 ACCEL-IN.7 | 5.82,41.93 5.79,41.96 C10.2 | 5.82,41.93 5.85,41.9 | RECIEVER-POWER.1 22.16,43.06 22.16,46.29 MOTOR-OUT.1 | GPS.2 44,25.6 43.45,25.05 38.75,25.05 v37.35,26.45 | v3.2,26 3.2,28.1 | 3.2,28.1 5,29.9 | v1.45,29.6 1.8,29.65 3.2,28.1 | v48.2,5.2 48.25,5.2 48.1,5.35 S1.2 45.41,2.86 45.36,2.81 | 45.36,2.81 45.35,2.8 | 45.36,2.81 S1.1 | 5.15,3.55 5.08,3.62 C9.1 5.25,3.6 5.25,4.7 5.1,4.85 3.9,4.85 2.67,6.08 SW2.2 4.09,7.14 4.4,7.45 4.4,7.5 | U4.21 8.04,17.75 7.3,17.75 7.1,17.75 6.3,18.55 4.8,18.55 U4.3 | SENSOR-LED1.1 5.35,6.55 4.4,7.5 | 4.4,7.5 4.4,7.75 3.65,8.5 3.65,9.6 v3.6,9.75 1.77,11.48 POWER-LED.1 1.09,11.49 1.1,11.5 0.9,11.7 v0.9,14.75 | 5.82,41.98 5.85,41.95 | C10.2 5.82,41.98 | EXTERNAL-ON-OFF.2 3.27,44.53 5.82,41.98 | v0.9,14.75 0.95,14.75 1.11,14.59 Y2.2
  Top 0.3: 26.58,19.4 26.58,15.48 25.8,14.7 25.8,13.4 U1.21 | U1.3 26.58,19.4 | 26.58,19.4 26.58,19.08 | U4.5 2.94,16.95 2.4,17.5 2.4,18.1 2.9,18.6 4.8,18.6 4.9,18.5 U4.3
  Bottom 0.25: v48.2,5.2 48.2,5.6 49.55,7 49.55,17.05 48.39,18.36 FTDI.5 | FTDI.6 45.2,20.9 40.8,25.3 | 40.8,25.3 40.45,25.65 | MAG-IN.1 38.53,27.63 | 38.53,27.63 v37.35,26.45 | 27.25,20 v27.35,19.9 26.95,19.5 25,19.5 | 3.99,17.39 4,17.4 | 3.99,17.39 C1.2 | 3.99,17.39 3.87,17.27 C5.2 1.9,17.25 0.9,16.25 v0.9,14.75 0.95,14.75 0.45,15.25 0.45,20.4 0.7,20.65 3.1,20.65 4.18,21.73 4.18,21.78 | 3.15,10.85 2.15,9.85 2.15,7.55 C3.2 | 3.15,10.85 3.17,10.87 | v3.6,9.75 3.6,10.4 3.15,10.85 | 37.5,26.4 37.45,26.45 v37.35,26.45 | Y1.2 22.75,19.27 22.75,17.85 24.65,17.85 24.95,18.15 v24.95,19.5 25,19.5 | 25,19.5 24.95,19.45 | RECIEVER-POWER.1 21.96,40.91 21.95,40.9 21.95,40.85 | 30.15,35.55 30.13,35.57 ACCEL-IN.7 30.11,35.61 | 38.53,27.63 38.53,27.57 40.8,25.3 | 4.18,21.78 4.2,21.8 4.1,21.9 4.1,23.05 3.16,23.99 C8.2 3.16,25.96 v3.2,26 | 4.18,21.78 C7.2 | U2.2 2.07,30.62 v1.45,29.6 | C6.2 2.77,11.23 3.15,10.85 | C3.2 | C3.2 | v26.5,25 32.95,25 34.4,26.45 v37.35,26.45 | v18.7,42.95 19.85,42.95 21.95,40.85 | 21.95,40.85 27.6,40.85 30.15,38.3 30.15,35.65 30.11,35.61 | 30.11,35.61 30.1,35.6
  pour Bottom: 0,50 49.95,50 49.95,-0.05 0,-0.05
D2-CH1  (via drill 0.31)
  Top 0.25: RECIVER.6 46.55,45.7 46.55,45.65 43.55,42.65 43.55,38 v42.25,36.75 | U1.32 29.35,20.2 | U1.32 | U1.32 29.4,20.25 30.3,20.25 30.65,20.6 30.65,23.9 v25.6,29 25.55,29.2 | v40.8,35.35 40.8,34.35 38.8,32.35 35.7,32.35 35.15,31.8 35.2,31.8 34.9,31.5 33.55,31.5 33.4,31.65 v32.3,31.65
  Bottom 0.25: 30.7,30.85 27.8,30.85 25.95,29 v25.6,29 | 30.7,30.85 30.75,30.85 | 30.7,30.85 30.9,30.85 31.7,31.65 v32.3,31.65 | v40.8,35.35 v42.25,36.75
D2-INT  (via drill 0.31)
  Top 0.25: 6.1,21.25 6.05,21.2 | U4.32 6.1,21.25 | 6.1,21.25 | U4.32 | 6.1,21.4 U4.32 | U4.32 6.15,21.35 6,21.45 6,25.45 6.55,25.95 7.6,25.95 8.6,26.95 v9,26.95
  Bottom 0.25: GYRO-IN.3 10.61,47.71 10.6,47.7 10.6,36.15 4.8,30.35 4.8,27.8 5.55,27.05 8.95,27.05 9.05,26.95 v9,26.95
D4-CH2  (via drill 0.31)
  Top 0.25: RECIVER.5 45.86,43.16 44.4,41.7 44.4,37.1 v43.45,36.15 | U1.2 27.35,21.45 27.4,21.5 27.4,23.15 27.75,23.5 v27.75,24.3 | v41.65,34.65 41.55,34.65 41.55,34.35 38.7,31.5 38.7,31.45 35.65,31.45 34.8,30.6 v32.25,30.6
  Bottom 0.25: v43.45,36.15 43.15,36.15 v41.65,34.65 | v32.25,30.6 31.95,30.3 28,30.3 26.15,28.55 26.15,28.3 25.4,28.3 25.1,28 25.1,24.9 25.7,24.3 v27.75,24.3
D5-M1  (via drill 0.31)
  Top 0.25: 21.3,37.75 21.3,33.35 21.7,32.95 21.7,32.85 v21.75,32.8 | 21.3,37.75 21.3,37.8 | v19.75,29.3 21.4,29.3 v22.75,28.35 | 21.4,20.25 21.38,20.23 U1.9 | U1.9 21.4,20.2 | U1.9 21,20.6 21,22.65 21.05,22.65 21.35,22.95 21.35,25.05 21.8,25.5 v21.8,25.65 | MOTOR-OUT.6 32.95,44.6 32.95,44.3 27.05,44.3 26.1,43.35 26.1,41.85 25.5,41.25 21.75,41.25 21.1,40.6 21.1,38 21.35,37.75 21.3,37.75
  Bottom 0.25: v21.75,32.8 21.75,31.3 v19.75,29.3 | v21.8,25.65 22.3,25.65 22.75,26.1 22.75,28.3 22.7,28.35 v22.75,28.35
D6-M2  (via drill 0.31)
  Top 0.25: 21.45,19.45 21.42,19.42 U1.10 21.4,19.4 | v20.8,25.65 20.8,23.1 20.2,22.5 20.2,20.9 19.95,20.65 19.95,19.7 20.25,19.4 21.4,19.4 | 21.4,19.4 21.45,19.35 | v27.9,32.85 31.3,32.85 31.6,33.15 34.9,33.15 v35.6,33.85
  Bottom 0.25: v20.8,25.65 20.8,26.1 21.25,26.55 21.25,28.2 23.65,30.6 23.65,32.85 23.95,33.35 27.4,33.35 v27.9,32.85 | MOTOR-OUT.5 32.25,46.4 33.75,44.9 36.25,44.9 36.75,44.4 36.75,39.15 35.65,38.05 35.65,38.1 35.6,38.05 v35.6,33.85
D7-CH3  (via drill 0.31)
  Top 0.25: RECIVER.4 46.47,40.62 45.75,39.9 45.75,37.05 v44.15,35.45 | v42.35,33.9 41.85,33.9 38.75,30.8 38.7,30.85 35.95,30.85 34.95,29.85 v33.1,29.85 33.05,29.9 | U1.11 22.67,18.63 24,17.3 v25.15,17.3
  Bottom 0.25: v25.15,17.3 27.35,17.3 28.85,19.5 28.85,19.8 28.6,20.05 | 28.6,20.05 28.55,20.1 | v44.15,35.45 43.9,35.45 v42.35,33.9 | v33.1,29.85 33.15,29.9 33.1,29.95 33.1,32.6 32.7,33 31.5,33 30.85,32.35 30.85,31.65 30.55,31.35 27.65,31.35 26,29.7 24.95,29.7 24.5,29.3 24.5,25.45 23.9,24.85 23.9,22.9 25.75,21.25 26.9,21.25 26.95,21.2 26.95,21.25 27.4,21.25 28.6,20.05
D8-CH4  (via drill 0.31)
  Top 0.25: v43.05,33.2 41.5,32.65 38.75,29.9 35.95,29.9 34.9,28.85 32.2,28.85 v32,29.05 | v18.85,41.25 16.1,42.6 12.15,42.6 11.85,42.9 11.85,44.15 12.45,44.15 13,44.7 R15.2 | U1.12 | v25.75,38.6 26.05,38.9 33.75,38.9 36.3,41.45 36.3,43.35 37.15,44.2 39.6,44.2 42.1,41.7 v42.1,38.7 | 21.45,17.8 21.43,17.82 U1.12 | 19.4,26.15 19.4,18.75 20.3,17.85 21.45,17.85 21.48,17.82 | 19.4,26.15 19.4,26.4 | 21.48,17.82 21.5,17.8 | 21.48,17.82 U1.12 | v25.85,27.5 19.7,27.5 19.4,27.2 19.4,26.15
  Bottom 0.25: 47.84,38.06 47.85,38.05 | 47.84,38.06 RECIVER.3 47.84,37.74 46.1,36 45.8,36 43.05,33.25 v43.05,33.2 | v42.1,38.7 47.2,38.7 47.84,38.06 | v25.85,27.5 31.8,27.5 32,27.7 v32,29.05 | v18.85,41.25 20.4,41.25 23.05,38.6 v25.75,38.6
D9-M3  (via drill 0.31)
  Top 0.25: 20.6,45.2 20.6,37.85 19.95,37.45 13.8,37.45 13.75,37.15 13.75,32.95 17.95,28.75 17.95,25.95 18.75,25.15 18.75,18 19.75,17 21.3,17 21.33,17.03 U1.13 | 20.6,45.2 20.6,45.25 | 20.6,45.2 v20.6,47.6
  Bottom 0.25: MOTOR-OUT.4 29.65,46.4 28.3,47.75 28.3,48.05 23.65,48.05 23.65,47.95 23.2,47.7 22.2,47.7 21.95,47.85 20.85,47.85 v20.6,47.6
D10-M4
  Top 0.25: 19.9,48.55 19.95,38.6 19.05,38.05 13.6,38.1 13.15,37.3 13.2,33.35 13.2,32.65 16.75,29.1 16.75,26.2 18.25,24.7 18.25,17.55 19.55,16.25 21.35,16.25 21.36,16.25 U1.14 | MOTOR-OUT.3 28.2,47.45 28.2,49.5
  Top 0.3: 19.9,48.5 19.9,48.55 21,49.5 28.2,49.5
D11/MOSI  (via drill 0.31)
  Top 0.25: U4.15 10.9,12.2 11,12.1 | 11,12.1 18.6,12.1 v20.2,13.7 | U1.15 21.4,15.4 v19.7,15.4 | 11,12.1 12.7,12.1
  Bottom 0.25: v20.2,13.7 20.2,14.9 v19.7,15.4
D12/MISO
  Top 0.3: U4.16 18.84,13.34 20.1,14.6 21.4,14.6 21.38,14.62 U1.16
D13/SCK  (via drill 0.31)
  Top 0.25: 12.9,14.6 13.71,14.6 13.95,14.35 v14.8,14.35 14.85,14.35
  Top 0.3: U1.17 22.59,12.69 v22,11.9 | 12.9,14.6 U4.17
  Bottom 0.25: v22,11.9 22,10.25 21.7,9.95 15.75,9.95 | 15.75,9.95 14.85,10.85 14.85,14.4 14.8,14.4 v14.8,14.35 | 15.75,9.95 17.55,9.95
DAUX1
  Top 0.25: 6.27,9.93 7.15,9 11.95,9 14.39,6.81 | 6.27,9.93 6.25,9.95 | 14.39,6.81 14.4,6.8 | 14.39,6.81 AUX-IO.13 | R9.2 5.43,12.63 6.1,13.3 U4.9 6.1,10.15 6.3,9.95 6.28,9.93 6.27,9.93
DAUX2
  Top 0.25: 7.75,9.5 7.7,9.5 | 7.75,9.5 12.15,9.5 13.75,8.3 15.45,8.3 AUX-IO.11 | AUX-IO.11 16.95,6.8 | AUX-IO.11 | U4.10 6.91,12.46 6.65,12.1 6.7,10.6 7.75,9.5
DAUX3  (via drill 0.31)
  Top 0.25: AUX-IO.9 19.45,6.8 17.4,8.8 14.1,8.8 12.8,9.95 8.6,10 7.7,10.7 7.7,11.45 v7.55,11.8 | 4.9,20.1 | 4.9,20.1 U4.1 | 4.9,20.1 3.15,20.1 2.65,20.6 2.65,22.95 3,23.3 4.7,23.3 4.8,23.2 v4.8,23.25
  Bottom 0.25: v7.55,11.8 6.9,11.8 6.9,14.05 7.35,14.4 7.35,15.35 7.1,15.6 6.15,15.6 5.65,16.1 5.65,17.65 7.15,19.05 7.15,19.8 6.2,20.65 5.95,20.65 5.6,21 5.6,22.35 4.8,23.15 v4.8,23.25
DAUX4
  Top 0.25: U4.12 8.51,11.19 9.2,10.45 13.35,10.45 14.3,9.4 17.8,9.4 18.75,8.35 20.45,8.35 AUX-IO.7
DAUX5
  Top 0.25: U4.13 9.3,11.65 9.95,11 13.8,11 14.75,9.9 18.05,9.9 19.2,8.85 22.55,8.85 24.55,6.85 AUX-IO.5
DAUX6
  Top 0.25: AUX-IO.3 27.1,6.85 25.55,8.4 24.7,8.4 23.75,9.35 19.45,9.35 18.5,10.4 16.1,10.4 14.8,11.6 10.65,11.6 10.09,12.16 10.09,12.19 10.1,12.2 10.09,12.21 U4.14
DAUX7  (via drill 0.31)
  Top 0.25: v20.3,10.9 21.9,10.9 22.35,10.45 24.8,10.45 25,10.25 26.25,10.25 29.65,6.85 AUX-IO.1 | U1.1 28.18,21.53 28.2,21.55 28.2,20.6 28.1,20.4 28.1,19.55 27.25,18.8 v27.25,15.2
  Bottom 0.25: v20.3,10.9 20.3,12.25 21.35,13.3 26.7,13.3 27.25,13.85 v27.25,15.2
DTR
  Bottom 0.25: 45.25,8.4 45.45,8.2 45.45,8.05 | FTDI.1 48.35,8.2 48.18,8.37 C4.1 45.25,8.25 45.45,8.05 | 45.45,8.05 45.5,8
GPS-RX
  Top 0.25: S1.8 45.45,20.55 46,21.1 GPS.4
GPS-TX
  Top 0.25: GPS.3 45,23.15 43.7,21.85 43.7,18.4 44.1,18 45.3,18 45.4,18.1 45.41,18.09 S1.7
N$1  (via drill 0.31)
  Top 0.25: U1.8 21.87,21.43 v21.75,21.55
  Bottom 0.25: Y1.3 21.77,19.22 21.75,19.2 21.75,20.2 | 21.75,20.2 21.75,20.4 | 21.75,20.2 21.8,20.2 21.75,20.25 v21.75,21.55
N$2  (via drill 0.31)
  Top 0.25: U1.7 23.38,21.32 23.4,21.3 23.4,22.1 22.5,23 22.05,23 21.9,22.85 v21.9,22.5
  Bottom 0.25: v21.9,22.5 23.35,20.65 23.75,20.25 23.75,19.3 Y1.1 | Y1.1 23.8,19.25 | Y1.1
N$4
  Top 0.25: R9.1 5.04,10.61 5.04,9.11 SENSOR-LED1.2 | SENSOR-LED1.2 5.4,8.75 | SENSOR-LED1.2
N$5  (via drill 0.31)
  Top 0.25: 5VREG.1 5.86,32.96 v5.9,33.6 | v0.6,26.9 0.8,27.1 0.8,29.85 0.75,30.3 0.75,33.15 2.35,34.75 | 2.35,34.75 | v2.9,33.75 2.9,34.2 2.35,34.75 | EXTERNAL-ON-OFF.1 2.21,35.14 2.35,35 2.35,34.75
  Bottom 0.25: 5.81,33.51 v5.9,33.6 5.95,33.6 5.8,33.75 v2.9,33.75 | U2.1 1.1,30.85 0.4,30.1 0.4,27.15 v0.6,26.9 | U2.1
N$7
  Top 0.25: 16.3,44.9 16.15,44.75 R15.1 14.73,44.78 COMM-LED.2
N$28  (via drill 0.31)
  Top 0.25: POWER-LED.2 1.09,8.04 v1.05,8.05
  Bottom 0.25: 0.85,5.9 1.2,5.8 R12.2 1.2,5.65 1.05,5.8 v1.05,8.05
N$30
  Top 0.25: 2.41,15.59 2.4,15.6 | Y2.1 2.41,15.59 | U4.7 2.64,15.36 2.41,15.59
N$32
  Top 0.25: U4.8 3.94,13.59 Y2.3
N$34  (via drill 0.31)
  Top 0.25: v8.6,36.75 10.15,38.3 12.5,38.3 13.15,38.95 v18.8,38.95 18.85,38.95 | S1.15 36.35,5.35 35.8,5.9 35.7,5.9 34.92,6.68 34.92,8.18 33.5,10.8 33.5,23.75 32.5,24.75 31.6,24.75 25.95,30.4 20.65,30.4 20.06,30.99 20.04,30.99 | 20.04,30.99 20,31.05 | 20.04,30.99 20.05,31 17.9,33.15 17.9,33.85 19.66,35.61 ACCEL-IN.3
  Bottom 0.25: 19.99,35.61 20,35.6 | ACCEL-IN.3 19.99,35.61 | v18.8,38.95 18.85,36.75 19.99,35.61 | v8.6,36.75 8.6,36.7 8.28,36.38 R4.1
N$36
  Top 0.25: ACCEL-IN.2 17.41,35.61 17.35,35.55 17.35,32.75 20.2,29.9 25.7,29.9 31.45,24.15 32.25,24.15 32.75,23.65 32.75,15.85 33,15.3 33,8.95 34.15,7.8 34.15,3.95 35.3,2.8 36.35,2.8 36.36,2.81 S1.16
  Bottom 0.25: ACCEL-IN.2 | 17.4,35.6 17.41,35.61 ACCEL-IN.2 | R5.1 12.95,32.25 12.4,32.25 10.95,33.7 10.95,34.2 12.65,35.9 12.65,36.7 13.65,37.7 17,37.7 17.45,37.25 17.45,35.65 17.43,35.63 ACCEL-IN.2
N$41  (via drill 0.31)
  Top 0.25: v2.15,26.05 1.3,26 0.45,25.15 0.45,22.3 v0.7,22.05
  Bottom 0.25: 3.02,28.32 3.05,28.35 | 3.02,28.32 U2.4 | 3.02,28.32 3,28.3 3,26.9 v2.15,26.05 | C7.1 2,22.05 v0.7,22.05
RESET2  (via drill 0.31)
  Top 0.25: v28,16.65 28.02,17.82 U1.29 29.37,17.88 | 8.5,21.3 8.51,21.31 | 8.5,21.3 U4.29 | U4.29 | v31.65,21.1 31.65,20.2 32.2,19.65 32.2,18 31.85,17.65 30.95,17.65 30.72,17.88 29.37,17.88 | 29.37,17.88 29.35,17.9 | v2.95,8.75 2.45,8.4 2.35,8.35 2.2,8.35 0.8,6.95 0.7,6.95 0.4,6.5 0.4,2.9 0.6,2.75 2.75,2.75 3,3 2.98,3.02 SW2.1 | v6.7,23.7 6.7,24.4 8.1,25.8 8.75,25.8 9.3,25.25 9.3,25 8.6,24.3 v8.55,24.05 8.55,23.2 8.5,23.15 U4.29 | v9.05,19.85 8.7,19.85 8.5,20.05 8.5,21.3 | U4.29 8.55,21.35 U4.29
  Bottom 0.25: v2.95,8.75 3.4,9 4.7,9 6.75,11.05 7.9,11.05 8.2,11.35 8.25,11.35 8.25,12.35 7.9,12.65 7.95,12.65 7.9,12.7 7.9,15.45 8.95,16.95 8.95,19.05 9.05,19.15 v9.05,19.85 | C4.2 40.32,8.37 38.4,6.45 37.25,6.45 36.7,7 36.7,16.05 v31.65,21.1 | v28,16.65 27.95,16.6 21.35,16.6 16.5,21.45 | 16.5,21.45 16.45,21.5 | R8.1 7.03,24.82 7.03,24.03 v6.7,23.7 | v8.55,24.05 9.8,25.3 12.25,25.3 13.65,23.4 13.65,21.6 16.35,21.6 16.5,21.45
RX  (via drill 0.31)
  Top 0.25: S1.12 36.52,12.97 36.55,13 v34.6,13 | U1.30 31.07,18.63 v31.3,18.4
  Bottom 0.25: v31.3,18.4 31.3,18.3 32.65,16.95 32.65,14.9 34.6,12.95 v34.6,13
RX2  (via drill 0.31)
  Top 0.25: S1.10 35.95,18.05 v34.8,19.2 34.85,19.2 | S1.14 | S1.14 | v38.55,7.85 36.45,7.85 S1.14 | 34.85,19.2 34.9,19.15 | v34.75,23.75 34.75,19.3 34.85,19.2 | v8.3,25 7.7,24.4 7.7,21.15 U4.30 | 24.7,24.05 v24.65,24.1 24.4,24.35 v23.2,24.35
  Bottom 0.25: v34.8,19.2 38,19.2 38.75,18.45 38.75,8.05 v38.55,7.85 | v8.3,25 8.6,24.95 9.15,25.75 12.5,25.8 13.9,24.25 13.9,24.05 14.3,23.65 14.3,22.9 14.75,22.45 14.8,22.5 19.9,22.55 21.15,23.75 21.45,24.05 22.85,24.05 23.15,24.35 v23.2,24.35 | v24.65,24.1 24.85,24.1 25.3,23.65 27.3,23.65 27.4,23.55 34.55,23.55 v34.75,23.75
RX-IN
  Top 0.25: 48.35,13.3 48.37,13.28 FTDI.3 | 45.41,12.91 45.4,12.9 | 45.41,12.91 S1.5 | 48.35,13.3 45.8,13.3 45.41,12.91 | 48.35,13.3 48.35,12.8 46.85,11.45 46.85,9.35 45.82,8.17 45.77,8.17 45.45,7.85 S1.3 45.46,7.89 45.5,7.85
SCL  (via drill 0.31)
  Top 0.25: 10.09,21.34 10,21.25 | U4.27 10.09,21.34 | 10.09,21.34 10.2,21.45 10.2,23.9 10.6,24.3 10.6,26.05 10.8,26.25 15.15,26.25 v15.35,26.45 | 41.88,45.22 41.9,45.2 | 41.88,45.22 I2C.1 | v38.8,45.3 41.85,45.25 41.88,45.22
  Bottom 0.25: 18.25,47.7 18.23,47.72 GYRO-IN.6 | 18.25,47.7 18.8,48.65 35.75,48.65 37.5,46.8 37.5,43.25 38.4,42.35 MAG-IN.4 38.38,44.83 v38.8,45.3 | 20.6,39.05 21.35,38.3 21.35,34.4 18.3,31.35 13.7,31.35 13.7,31.25 14,30.95 14,27.35 | 20.6,39.05 20.55,39.1 | v15.35,26.45 v15.34,26.46 | 18.25,47.7 18.25,43.8 17.9,43.45 17.9,40.5 18.7,39.7 19.95,39.7 20.6,39.05 | v15.35,26.45 15.4,26.45 | v15.35,26.45 14.9,26.45 14,27.35 | 14,27.35 14,27.3 13.65,26.95 10.95,26.95 9.7,28.2 9.7,28.5 10.49,29.29 10.49,29.39 10.84,29.74 | 10.84,29.74 10.85,29.75 | 10.84,29.74 R3.1
SDA  (via drill 0.31)
  Top 0.25: 9.35,21.05 9.3,21.1 U4.28 | U4.28 9.35,21.3 | U4.28 | U4.28 | 9.3,21.3 9.25,21.25 | U4.28 9.3,21.3 | 9.3,21.3 9.3,23.65 9.9,24.25 9.9,26.8 v10.05,26.95
  Bottom 0.25: 40.2,47.25 39.6,47.85 38.5,47.85 37.15,49.5 17.05,49.5 15.69,47.99 GYRO-IN.5 15.34,47.34 13,45 12.35,44.4 11.8,43.85 11.85,43.85 11.2,43.05 11.2,35.9 7.9,32.75 7.9,32.6 5.5,30.2 5.5,27.95 5.9,27.55 8.55,27.55 8.65,27.65 9.5,27.65 | 40.2,47.25 40.2,40.35 39.6,39.75 38.5,39.75 38.4,39.65 38.38,39.67 MAG-IN.3 | I2C.2 41.85,47.8 41.3,47.25 40.2,47.25 | v10.05,26.95 9.5,27.65 | R6.1 8.54,28.61 9.5,27.65
TX  (via drill 0.31)
  Top 0.25: S1.11 36.3,15.6 v34.7,15.6 | U1.31 31.32,19.42 v31.35,19.45
  Bottom 0.25: v31.35,19.45 31.55,19.15 33.7,17 33.7,16.6 v34.7,15.6
TX2  (via drill 0.31)
  Top 0.25: U4.31 6.91,20.29 7.45,19.75 7.45,19.6 8,18.9 10.35,18.9 v11.45,19.9 | S1.13 36.45,10.4 38.15,10.4 39,11.25 39,19.9 38.31,20.59 S1.9 36.31,20.59 36.3,20.6 36.45,20.75 v36.45,22.4 | v15.15,19.8 15.15,19.85 v17.4,21.75 | v23.15,23.4 24.5,23.4 v24.8,23.1
  Bottom 0.25: v11.45,19.9 15.05,19.9 v15.15,19.8 | v17.4,21.75 20.15,21.75 21.65,23.25 23,23.25 v23.15,23.4 | v24.8,23.1 25,23.1 25.3,22.8 36.05,22.8 v36.45,22.4
TX-IN  (via drill 0.31)
  Top 0.25: S1.4 45.45,10.4 | S1.4 | S1.4 45.05,10.8 | 45.05,10.8 44.9,10.95 | 45.05,10.8 44.95,10.7 44.9,10.75 v44.9,11.75 44.85,11.8 44.25,11.8 43.5,12.55 43.5,14.8 44.21,15.51 45.44,15.51 | 45.44,15.51 S1.6 | 45.44,15.51 45.5,15.45
  Bottom 0.25: 48.41,10.74 48.45,10.7 | 48.41,10.74 FTDI.2 | v44.9,11.75 47.4,11.75 48.41,10.74

### Text on the board
tPlace: Batt - | Gyro | R15 | Motor outputs | Comm status | I2C | C10 | Batt + | Reciever power | F1 | C2 | Accelerometer | PTC | Reciever input | 5VREG | Compass | GPS | U4 | Y2 | U1 | R9 | Power | Sensor | FTDI | Reset | C9 | Aux I/O
bPlace: R4 | R2 | R1 | R5 | U2 | R8 | Quadrotor, revision 1 | C8 | C7 | Y1 | C5 | C1 | Hunter Scott | 6/21/2011 | C6 | C3 | R12